# Altium schematic sheet Main.SchDoc
size A4; SheetNumber: 1; SheetTotal: 3
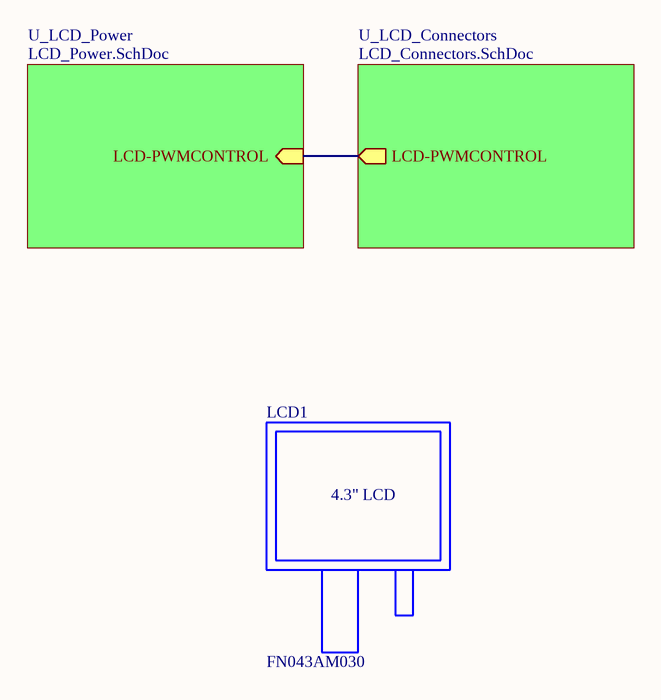
[diagram p0: Main.SchDoc]

## Parts
LCD1  FN043AM030  [LCD_4.3"]

## Sub-sheets
U_LCD_Connectors = LCD_Connectors.SchDoc: LCD-PWMCONTROL (out)
U_LCD_Power = LCD_Power.SchDoc: LCD-PWMCONTROL (in)

## Nets
(unnamed): sheet U_LCD_Power/LCD-PWMCONTROL, sheet U_LCD_Connectors/LCD-PWMCONTROL

## Notes on the sheet
- (in symbol FN043AM030) 4.3" LCD

## Library data of the parts
LCD1 = FN043AM030: TFT 4.3” 480X272 WITH CTP FT5426; Manufacturer: FANNAL; MFC PN: FN043AM030; Value: FN043AM030; Assembly: *; Help URL: https://www.ozdisan.com/p/tft-paneller-381/fannal-fn043am030-v1-0-535823